# EAGLE schematic ADC_Memoria (EAGLE 9.5.2)
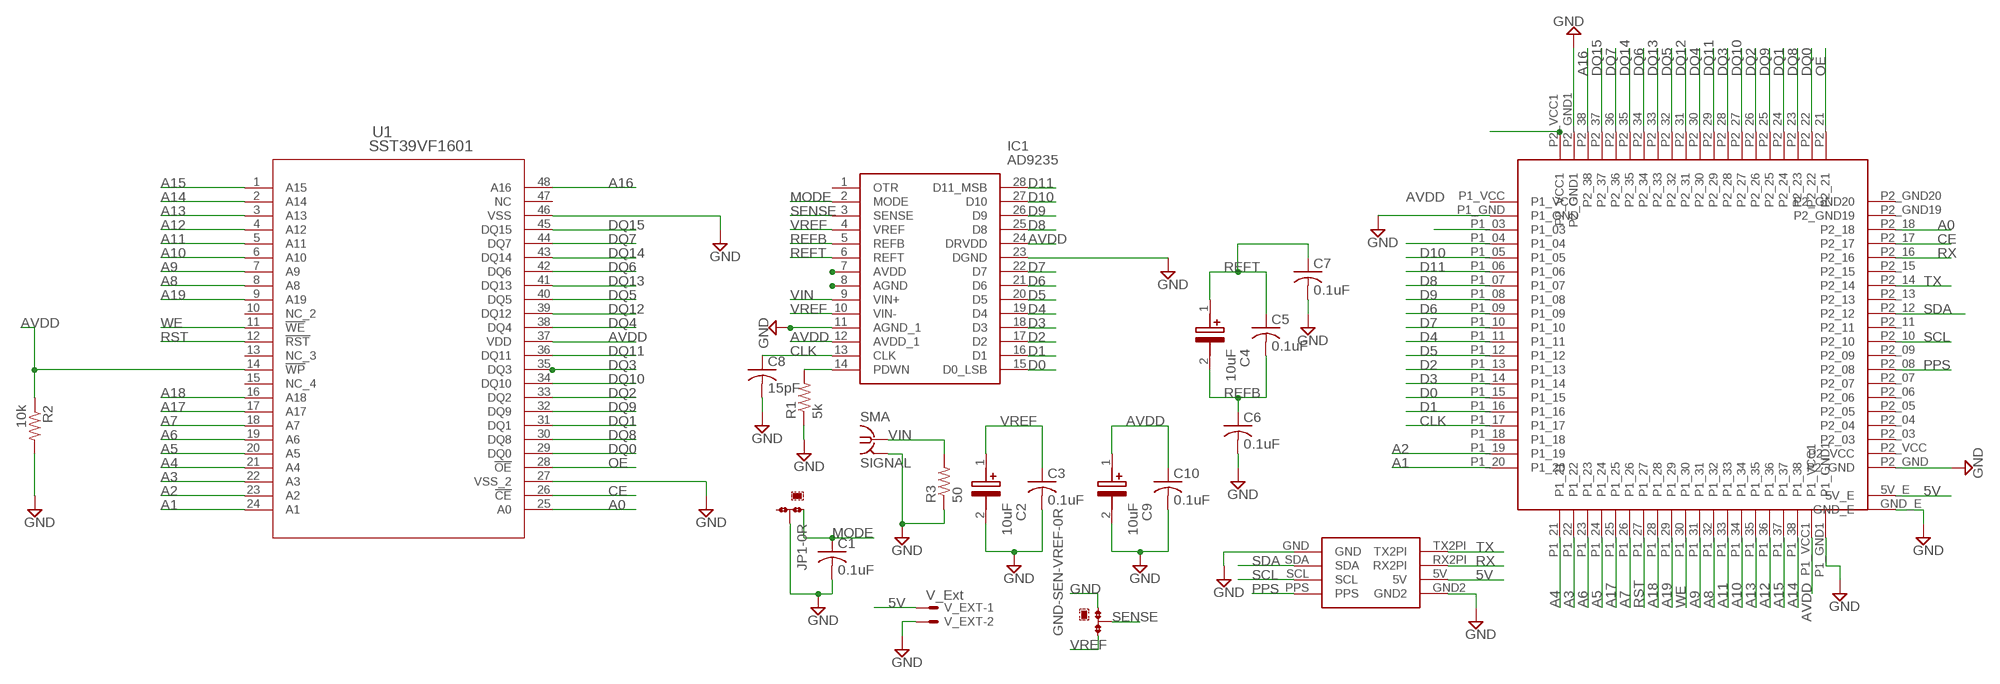
[diagram p0: schematic, sheet 1]

## Parts
C1  0.1uF  C-USC0805K  [C0805K]
C2  10uF  TAJC106K035RNJV  [CAPPM6032X280N]
C3  0.1uF  C-USC0805K  [C0805K]
C4  10uF  TAJC106K035RNJV  [CAPPM6032X280N]
C5  0.1uF  C-USC0805K  [C0805K]
C6  0.1uF  C-USC0805K  [C0805K]
C7  0.1uF  C-USC0805K  [C0805K]
C8  15pF  C-USC0805K  [C0805K]
C9  10uF  TAJC106K035RNJV  [CAPPM6032X280N]
C10  0.1uF  C-USC0805K  [C0805K]
GND-SEN-VREF  JP2  0R-JUMPA  [A0R-JMP]
IC1  AD9235  AD9235BRUZ-65  [SOP65P638X110-28N]
JP1  GND MODE  0R-JUMPA  [A0R-JMP]
R1  5k  R-US_R0805  [R0805]
R2  10k  R-US_R0805  [R0805]
R3  50  R-US_R0805  [R0805]
SMA  SIGNAL  SMA-142-0711-821/826  [J502-ND-142-0711-821/826]
U1  SST39VF1601  SST39VF1601-70-4C-EKETSOP48_EKE_SST-L  [TSOP48_EKE_SST-L]
U$1  SPARTAN_NO_HOLES  [SPARTAN_NO_HOLES]
U$2  CAPA1  [CAPA1]
V_EXT  V_Ext  JST-XH-02-PIN-LONG-PAD  [JST-XH-02-PACKAGE-LONG-PAD]

## Nets
5V: U$1.5V_E U$2.5V V_EXT.1
A0: U1.25(A0) U$1.P2_18
A1: U1.24(A1) U$1.P1_20
A2: U1.23(A2) U$1.P1_19
A3: U1.22(A3) U$1.P1_22
A4: U1.21(A4) U$1.P1_21
A5: U1.20(A5) U$1.P1_24
A6: U1.19(A6) U$1.P1_23
A7: U1.18(A7) U$1.P1_26
A8: U1.8(A8) U$1.P1_32
A9: U1.7(A9) U$1.P1_31
A10: U1.6(A10) U$1.P1_34
A11: U1.5(A11) U$1.P1_33
A12: U1.4(A12) U$1.P1_36
A13: U1.3(A13) U$1.P1_35
A14: U1.2(A14) U$1.P1_38
A15: U1.1(A15) U$1.P1_37
A16: U1.48(A16) U$1.P2_38
A17: U1.17(A17) U$1.P1_25
A18: U1.16(A18) U$1.P1_28
A19: U1.9(A19) U$1.P1_29
AVDD: C9.1(+) C10.1 IC1.12(AVDD_1) IC1.24(DRVDD) R2.1 U1.14(!WP) U1.37(VDD) U$1.P1_VCC1 U$1.P2_VCC1
CE: U1.26(!CE) U$1.P2_17
CLK: C8.1 IC1.13(CLK) U$1.P1_17
D0: IC1.15(D0_LSB) U$1.P1_15
D1: IC1.16(D1) U$1.P1_16
D2: IC1.17(D2) U$1.P1_13
D3: IC1.18(D3) U$1.P1_14
D4: IC1.19(D4) U$1.P1_11
D5: IC1.20(D5) U$1.P1_12
D6: IC1.21(D6) U$1.P1_09
D7: IC1.22(D7) U$1.P1_10
D8: IC1.25(D8) U$1.P1_07
D9: IC1.26(D9) U$1.P1_08
D10: IC1.27(D10) U$1.P1_05
D11: IC1.28(D11_MSB) U$1.P1_06
DQ0: U1.29(DQ0) U$1.P2_22
DQ1: U1.31(DQ1) U$1.P2_24
DQ2: U1.33(DQ2) U$1.P2_26
DQ3: U1.35(DQ3) U$1.P2_28
DQ4: U1.38(DQ4) U$1.P2_30
DQ5: U1.40(DQ5) U$1.P2_32
DQ6: U1.42(DQ6) U$1.P2_34
DQ7: U1.44(DQ7) U$1.P2_36
DQ8: U1.30(DQ8) U$1.P2_23
DQ9: U1.32(DQ9) U$1.P2_25
DQ10: U1.34(DQ10) U$1.P2_27
DQ11: U1.36(DQ11) U$1.P2_29
DQ12: U1.39(DQ12) U$1.P2_31
DQ13: U1.41(DQ13) U$1.P2_33
DQ14: U1.43(DQ14) U$1.P2_35
DQ15: U1.45(DQ15) U$1.P2_37
GND: C1.2 C2.2(-) C3.2 C6.2 C7.2 C8.2 C9.2(-) C10.2 GND-SEN-VREF.1 IC1.11(AGND_1) IC1.23(DGND) JP1.2 R1.1 R2.2 R3.1 SMA.G@1 SMA.G@2 SMA.G@3 SMA.G@4 U1.27(VSS_2) U1.46(VSS) U$1.GND_E U$1.P1_GND U$1.P1_GND1 U$1.P2_GND U$1.P2_GND1 U$2.GND U$2.GND2 V_EXT.2
MODE: C1.1 IC1.2(MODE) JP1.1
N$1: IC1.7(AVDD)
N$2: IC1.8(AGND)
N$5: U$1.P1_03
N$13: IC1.14(PDWN) R1.2
N$18: U$1.P1_04
OE: U1.28(!OE) U$1.P2_21
PPS: U$1.P2_08 U$2.PPS
REFB: C4.2(-) C5.2 C6.1 IC1.5(REFB)
REFT: C4.1(+) C5.1 C7.1 IC1.6(REFT)
RST: U1.12(!RST) U$1.P1_27
RX: U$1.P2_16 U$2.RX2PI
SCL: U$1.P2_10 U$2.SCL
SDA: U$1.P2_12 U$2.SDA
SENSE: GND-SEN-VREF.2 IC1.3(SENSE)
TX: U$1.P2_14 U$2.TX2PI
VIN: IC1.9(VIN+) R3.2 SMA.1
VREF: C2.1(+) C3.1 GND-SEN-VREF.3 IC1.4(VREF) IC1.10(VIN-)
WE: U1.11(!WE) U$1.P1_30
Unconnected: IC1.1(OTR) JP1.3 U1.10(NC_2) U1.13(NC_3) U1.15(NC_4) U1.47(NC) U$1.P1_18 U$1.P1_VCC U$1.P2_03 U$1.P2_04 U$1.P2_05 U$1.P2_06 U$1.P2_07 U$1.P2_09 U$1.P2_11 U$1.P2_13 U$1.P2_15 U$1.P2_GND19 U$1.P2_GND20 U$1.P2_VCC

## Library data of the parts
C1 C3 C5-C8 C10 = rcl:C-US: CAPACITOR, American symbol; SPICEPREFIX: C
C2 C4 C9 = TAN_Capacitor_2312_10UF:TAJC106K035RNJV: Tantalum Capacitors - Solid SMD 35V 10uF 10% 2312 ESR = 1 Ohms Source: Datasheet <https://componentsearchengine.com/Datasheets/1/TAJC106K035RNJV.pdf>; DESCRIPTION: Tantalum Capacitors - Solid SMD 35V 10uF 10% 2312 ESR = 1 Ohms; HEIGHT: 2.8mm; MANUFACTURER_NAME: AVX; MANUFACTURER_PART_NUMBER: TAJC106K035RNJV; MOUSER_PART_NUMBER: 581-TAJC106K035RNJV; MOUSER_PRICE-STOCK: https://www.mouser.com/Search/Refine.aspx?Keyword=581-TAJC106K035RNJV
GND-SEN-VREF JP1 = jump-0r-smd:0R-JUMP: SMD 0R 0805 Jumper
IC1 = AD9235BRUZ-65:AD9235BRUZ-65: AD9235BRUZ-65, 12 bit ADC Differential,, Parallel, 28-Pin TSSOP Source: Datasheet <https://componentsearchengine.com/Datasheets/1/AD9235BRUZ-65.pdf>; DESCRIPTION: AD9235BRUZ-65, 12 bit ADC Differential,, Parallel, 28-Pin TSSOP; HEIGHT: 1.1mm; MANUFACTURER_NAME: Analog Devices; MANUFACTURER_PART_NUMBER: AD9235BRUZ-65; MOUSER_PART_NUMBER: 584-AD9235BRUZ-65; MOUSER_PRICE-STOCK: https://www.mouser.com/Search/Refine.aspx?Keyword=584-AD9235BRUZ-65
R1-R3 = rcl:R-US_: RESISTOR, American symbol; SPICEPREFIX: R
SMA = con-coax:SMA-: SMA 50 Ohm End Launch Jack Receptacle - Round Contact Johnson Components Source: www.johnsoncomponents.com .. J502-ND.pdf; MF: JOHNSON COMPONENTS; MPN: 142-0711-821; OC_FARNELL: 1019328; OC_NEWARK: 16F3627
U1 = Memoria_SST39VF1601C:SST39VF1601-70-4C-EKE; BUILT_BY: EMA_UL_Team; MANUFACTURER_PART_NUMBER: sst39vf1601-70-4c-eke; VENDOR: Microchip
U$1 = SPARTAN_6_NIMAS:SPARTAN_NO_HOLES
U$2 = CAPA1:CAPA1
V_EXT = Connectors JST XH:JST-XH-02-PIN: JST XH Connector 2 Pin Wire to board connector. Pitch: 2,54 mm, (0.100") Number of pins: 2 Created by Rembrandt Electronics www.rembrandtelectronics.com